# Altium schematic sheet Altium_Example_SCHDOC.SchDoc
size A4; SheetNumber: 1; SheetTotal: 1
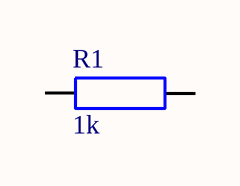
[diagram p0: Altium_Example_SCHDOC.SchDoc]

## Parts
R1  1k  [Resistencia]

## Nets

Not connected (* = marked no-connect by the designer): R1 1 2